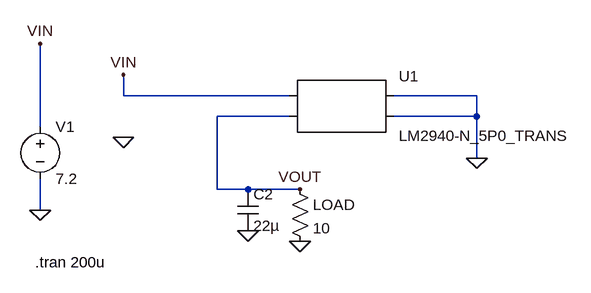
[diagram p0: schematic Draft1.asc]
Draft1.asc, the LTspice schematic file:
Version 4
SHEET 1 880 680
WIRE 0 96 0 64
WIRE 256 96 0 96
WIRE 544 96 416 96
WIRE 256 128 144 128
WIRE 544 128 544 96
WIRE 544 128 416 128
WIRE -128 144 -128 16
WIRE 544 192 544 128
WIRE 144 240 144 128
WIRE 192 240 144 240
WIRE 272 240 192 240
WIRE -128 272 -128 224
FLAG -128 272 0
FLAG 544 192 0
FLAG -128 16 VIN
FLAG 0 64 VIN
FLAG 0 160 0
FLAG 272 240 VOUT
FLAG 192 304 0
FLAG 272 320 0
SYMBOL voltage -128 128 R0
WINDOW 123 0 0 Left 0
WINDOW 39 0 0 Left 0
SYMATTR InstName V1
SYMATTR Value 7.2
SYMBOL AutoGenerated\\LM2940-N_5P0_TRANS 336 112 R0
SYMATTR InstName U1
SYMBOL cap 176 240 R0
SYMATTR InstName C2
SYMATTR Value 22µ
SYMBOL res 256 224 R0
SYMATTR InstName LOAD
SYMATTR Value 10
TEXT -136 352 Left 2 !.tran 200u

The netlist it stands for:
* Draft1.asc
V1 VIN 0 7.2
* U1: LM2940-N_5P0_TRANS (symbol AutoGenerated\LM2940-N_5P0_TRANS not available, pins judged from their places): pin1=VIN pin2=VOUT pin3=0 pin4=0
C2 VOUT 0 22µ
R§LOAD VOUT 0 10
.tran 200u
.backanno
.end